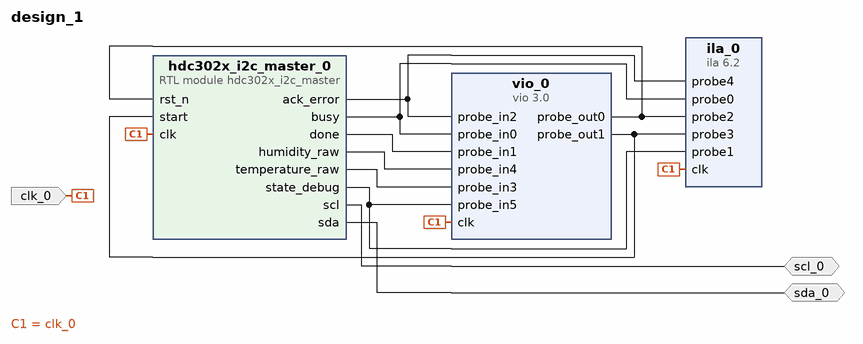
[diagram p0: block diagram of the top level]
# Vivado block design design_1, xczu7cg-ffvc1156-2-i, Vivado 2022.1
create_bd_design design_1

create_bd_port -dir I -type clk clk_0
create_bd_port -dir IO scl_0
create_bd_port -dir IO sda_0

create_bd_cell -type ip -vlnv xilinx.com:ip:vio:3.0 vio_0
set_property -dict {CONFIG.C_NUM_PROBE_IN 6 CONFIG.C_NUM_PROBE_OUT 2} [get_bd_cells vio_0]
create_bd_cell -type ip -vlnv xilinx.com:ip:ila:6.2 ila_0
set_property -dict [list \
  CONFIG.C_DATA_DEPTH 16384 \
  CONFIG.C_ENABLE_ILA_AXI_MON false \
  CONFIG.C_MONITOR_TYPE Native \
  CONFIG.C_NUM_OF_PROBES 5 \
] [get_bd_cells ila_0]
create_bd_cell -type module -reference hdc302x_i2c_master hdc302x_i2c_master_0

# ---- connections ----

connect_bd_net [get_bd_ports scl_0] [get_bd_pins hdc302x_i2c_master_0/scl]
connect_bd_net [get_bd_ports sda_0] [get_bd_pins hdc302x_i2c_master_0/sda]
connect_bd_net -net clk_0_1 [get_bd_ports clk_0] [get_bd_pins vio_0/clk] [get_bd_pins ila_0/clk] [get_bd_pins hdc302x_i2c_master_0/clk]
connect_bd_net [get_bd_pins hdc302x_i2c_master_0/ack_error] [get_bd_pins vio_0/probe_in2] [get_bd_pins ila_0/probe4]
connect_bd_net [get_bd_pins hdc302x_i2c_master_0/busy] [get_bd_pins vio_0/probe_in0] [get_bd_pins ila_0/probe0]
connect_bd_net [get_bd_pins hdc302x_i2c_master_0/done] [get_bd_pins vio_0/probe_in1]
connect_bd_net [get_bd_pins hdc302x_i2c_master_0/humidity_raw] [get_bd_pins vio_0/probe_in4]
connect_bd_net [get_bd_pins hdc302x_i2c_master_0/state_debug] [get_bd_pins vio_0/probe_in5] [get_bd_pins ila_0/probe1]
connect_bd_net [get_bd_pins hdc302x_i2c_master_0/temperature_raw] [get_bd_pins vio_0/probe_in3]
connect_bd_net [get_bd_pins vio_0/probe_out0] [get_bd_pins ila_0/probe2] [get_bd_pins hdc302x_i2c_master_0/rst_n]
connect_bd_net [get_bd_pins vio_0/probe_out1] [get_bd_pins ila_0/probe3] [get_bd_pins hdc302x_i2c_master_0/start]

validate_bd_design
save_bd_design
